# Altium schematic sheet note_commands_input.SchDoc
size A
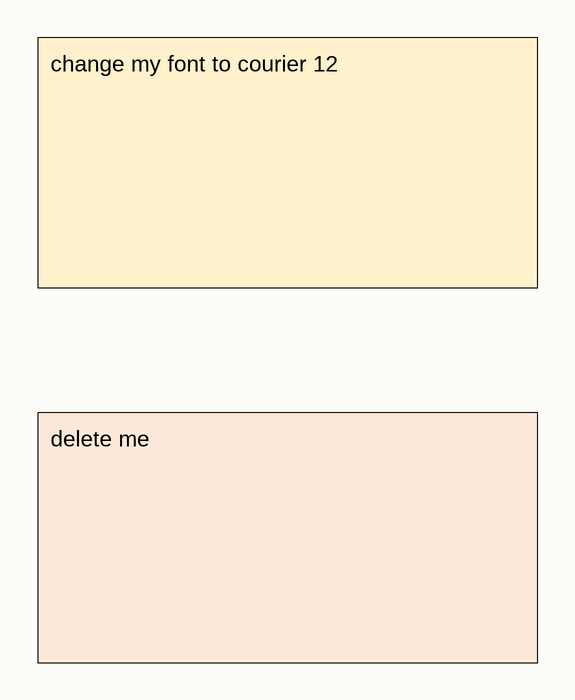
[diagram p0: note_commands_input.SchDoc]

## Notes on the sheet
- change my font to courier 12
- delete me